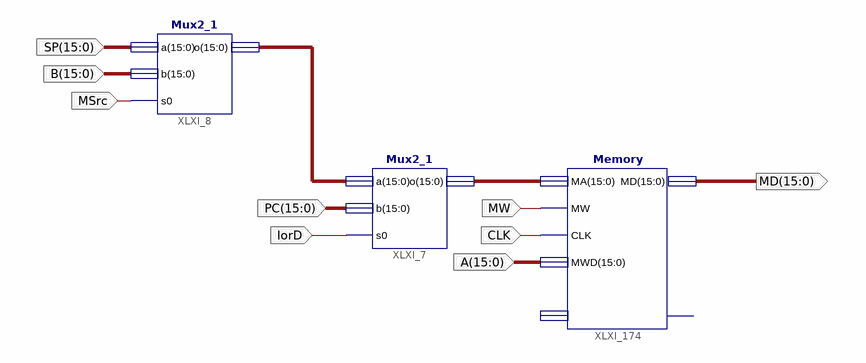
[diagram p0: schematic sheet 1]
// Xilinx ISE schematic IntegratedTestMemory.sch (spartan3e) as structural Verilog: 3 symbols, 9 ports
module IntegratedTestMemory (
  input  CLK,
  input  [15:0] A,
  input  [15:0] PC,
  input  MW,
  input  IorD,
  input  MSrc,
  input  [15:0] B,
  input  [15:0] SP,
  output [15:0] MD
);

  wire [15:0] XLXN_11, XLXN_40;

  Memory XLXI_174 (.MA(XLXN_40), .MW(MW), .CLK(CLK), .MWD(A), .MD(MD));  // open: segFault, SP
  Mux2_1 XLXI_7 (
    .a({XLXN_11[0], XLXN_11[1], XLXN_11[2], XLXN_11[3], XLXN_11[4], XLXN_11[5], XLXN_11[6], XLXN_11[7], XLXN_11[8], XLXN_11[9], XLXN_11[10], XLXN_11[11], XLXN_11[12], XLXN_11[13], XLXN_11[14], XLXN_11[15]}),
    .b(PC), .s0(IorD), .o(XLXN_40));
  Mux2_1 XLXI_8 (
    .a(SP), .b(B), .s0(MSrc),
    .o({XLXN_11[0], XLXN_11[1], XLXN_11[2], XLXN_11[3], XLXN_11[4], XLXN_11[5], XLXN_11[6], XLXN_11[7], XLXN_11[8], XLXN_11[9], XLXN_11[10], XLXN_11[11], XLXN_11[12], XLXN_11[13], XLXN_11[14], XLXN_11[15]}));
endmodule
